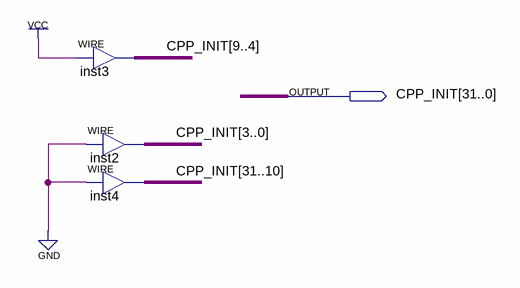
[diagram p0: schematic sheet]
// Quartus schematic CPP_INITIAL_ADRESS.bdf as structural Verilog: 3 symbols, 1 pins
module CPP_INITIAL_ADRESS (
  output [31:0] CPP_INIT
);

  assign CPP_INIT[9:4] = {6{1'b1}};  // WIRE inst3
  assign CPP_INIT[3:0] = 4'b0000;  // WIRE inst2
  assign CPP_INIT[31:10] = {22{1'b0}};  // WIRE inst4
endmodule
